# Altium schematic sheet SignalRouting.SchDoc: SignalRouting
size A3 portrait; Date: JUN 2020; ApprovedBy: Hören; CheckedBy: Mörz; Author: Rudziński; CompanyName: Semi-ATE; DrawnBy: Rudziński; Engineer: Hören; Organization: Semi-ATE; DocumentNumber: 7; Revision: V1.0; SheetNumber: 7; SheetTotal: 20
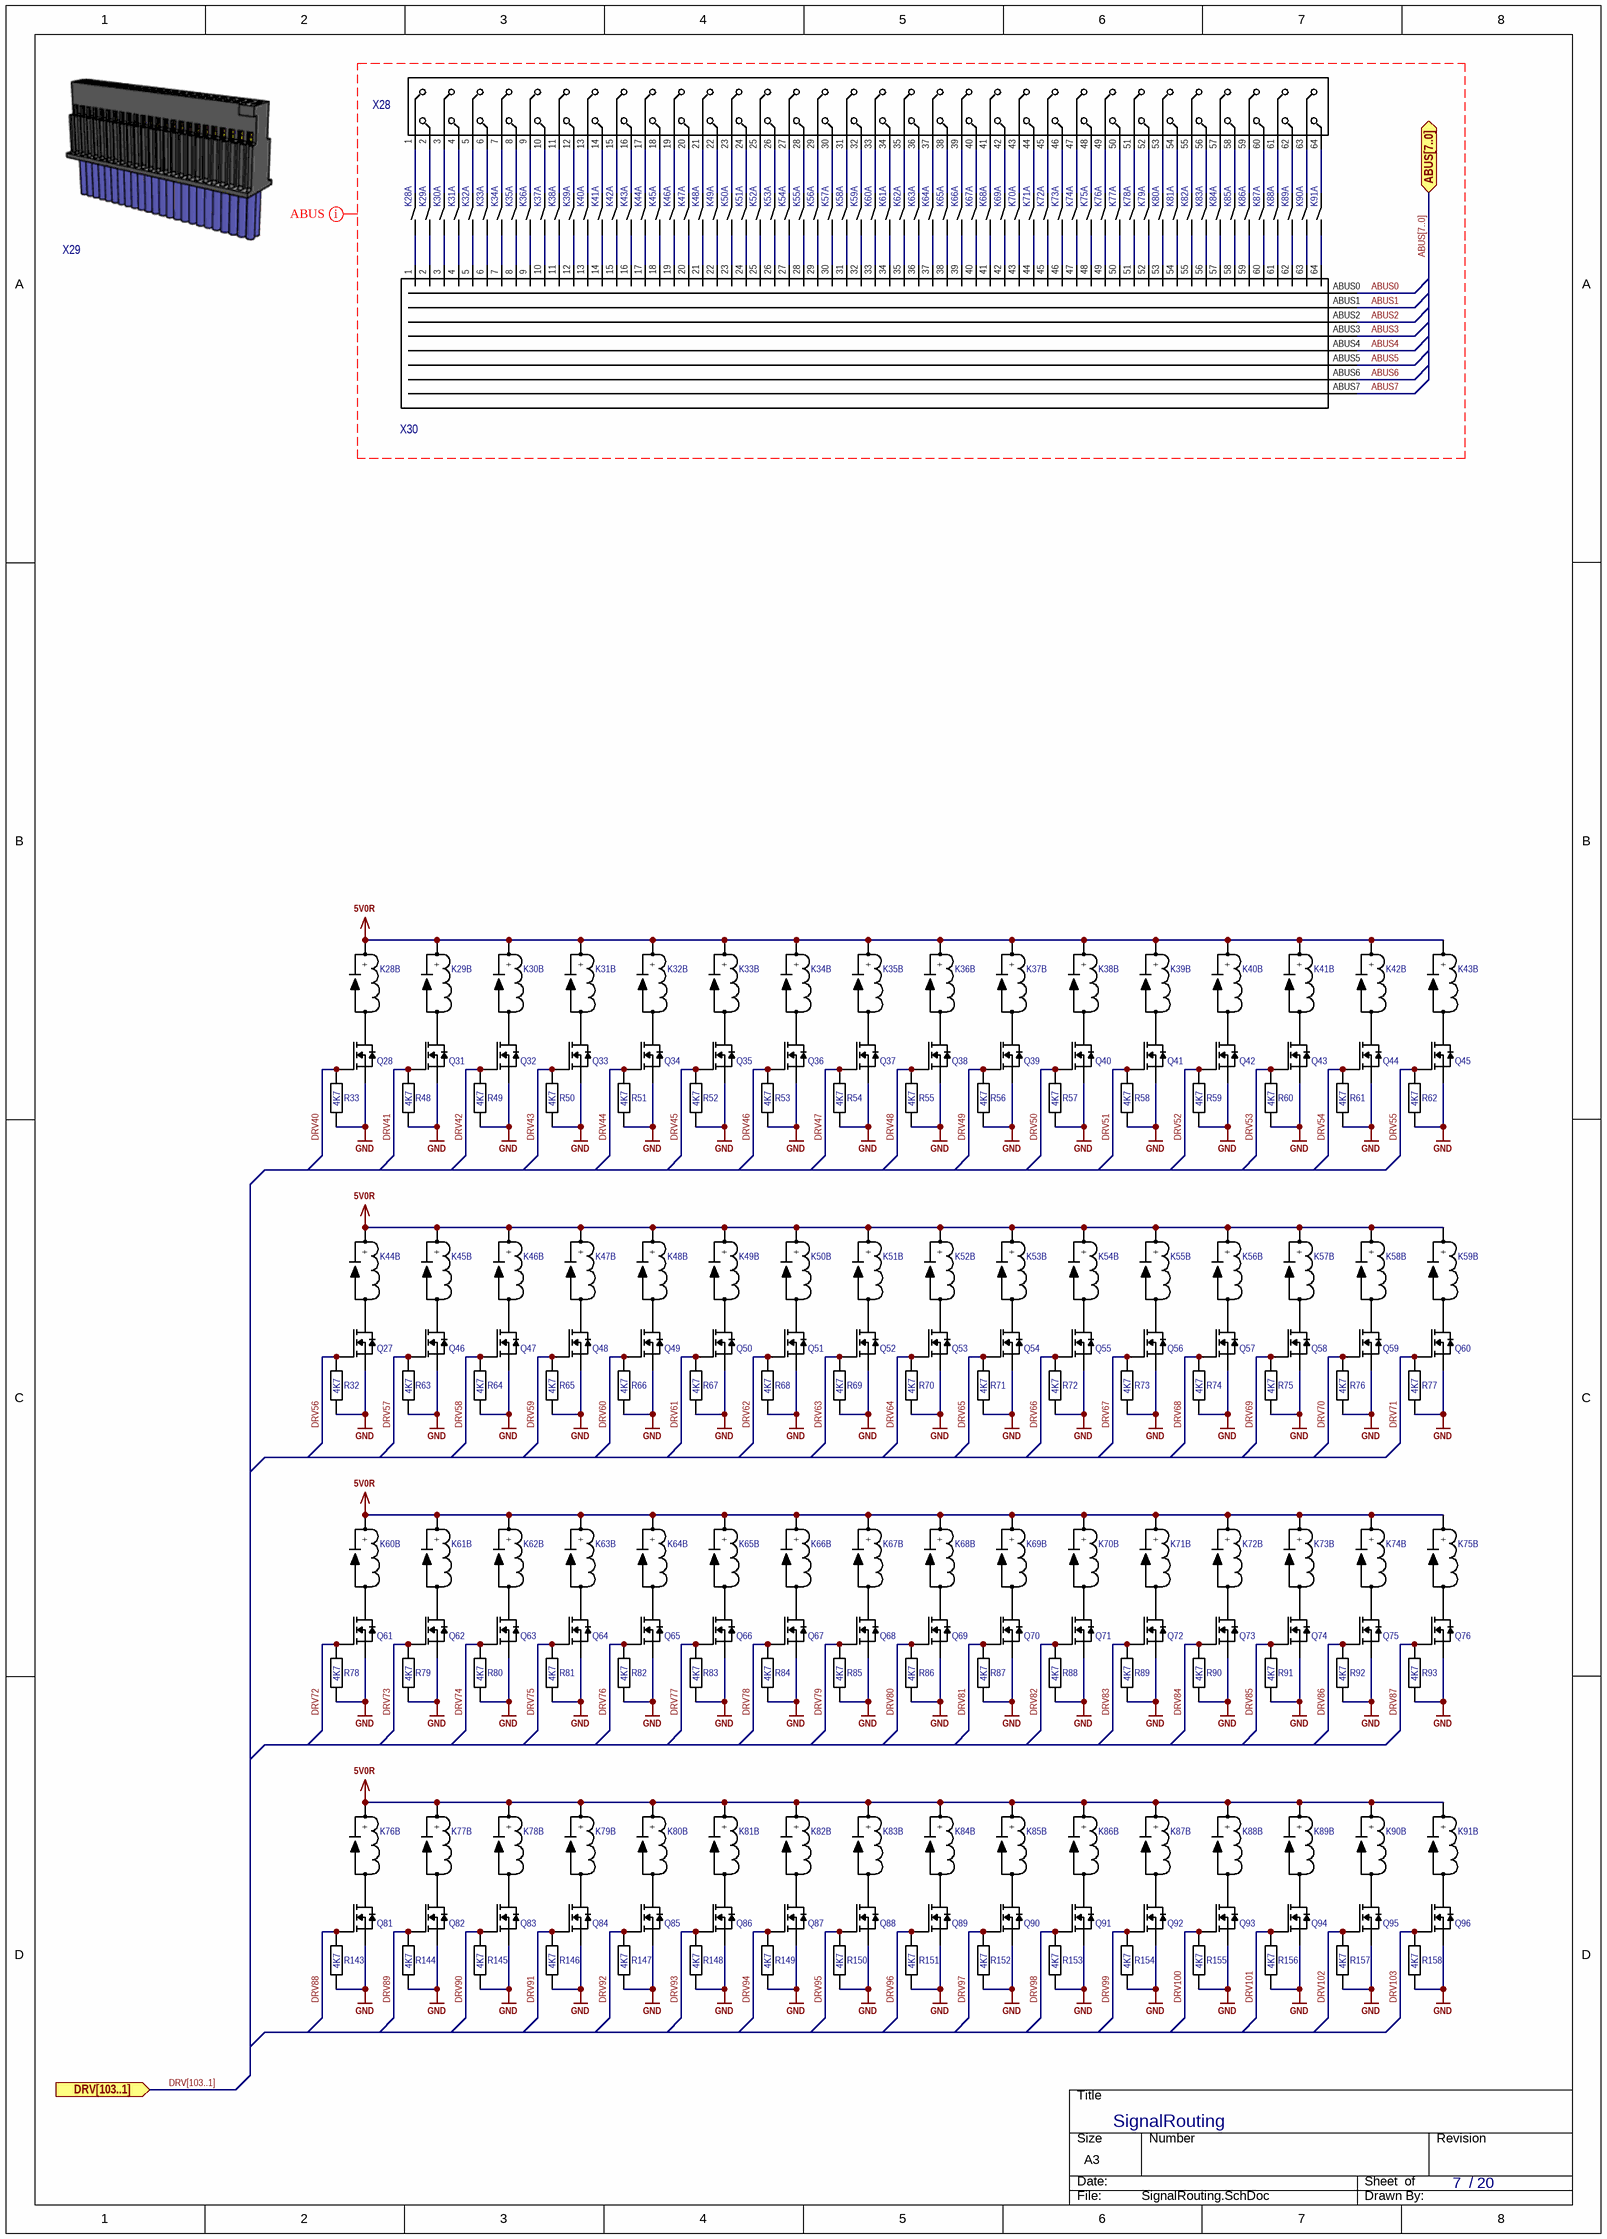
[diagram p0: SignalRouting.SchDoc]

## Parts
K28  K  [118-1A]  (value not drawn)  (parts A,B of 2)
K29  K  [118-1A]  (value not drawn)  (parts A,B of 2)
K30  K  [118-1A]  (value not drawn)  (parts A,B of 2)
K31  K  [118-1A]  (value not drawn)  (parts A,B of 2)
K32  K  [118-1A]  (value not drawn)  (parts A,B of 2)
K33  K  [118-1A]  (value not drawn)  (parts A,B of 2)
K34  K  [118-1A]  (value not drawn)  (parts A,B of 2)
K35  K  [118-1A]  (value not drawn)  (parts A,B of 2)
K36  K  [118-1A]  (value not drawn)  (parts A,B of 2)
K37  K  [118-1A]  (value not drawn)  (parts A,B of 2)
K38  K  [118-1A]  (value not drawn)  (parts A,B of 2)
K39  K  [118-1A]  (value not drawn)  (parts A,B of 2)
K40  K  [118-1A]  (value not drawn)  (parts A,B of 2)
K41  K  [118-1A]  (value not drawn)  (parts A,B of 2)
K42  K  [118-1A]  (value not drawn)  (parts A,B of 2)
K43  K  [118-1A]  (value not drawn)  (parts A,B of 2)
K44  K  [118-1A]  (value not drawn)  (parts A,B of 2)
K45  K  [118-1A]  (value not drawn)  (parts A,B of 2)
K46  K  [118-1A]  (value not drawn)  (parts A,B of 2)
K47  K  [118-1A]  (value not drawn)  (parts A,B of 2)
K48  K  [118-1A]  (value not drawn)  (parts A,B of 2)
K49  K  [118-1A]  (value not drawn)  (parts A,B of 2)
K50  K  [118-1A]  (value not drawn)  (parts A,B of 2)
K51  K  [118-1A]  (value not drawn)  (parts A,B of 2)
K52  K  [118-1A]  (value not drawn)  (parts A,B of 2)
K53  K  [118-1A]  (value not drawn)  (parts A,B of 2)
K54  K  [118-1A]  (value not drawn)  (parts A,B of 2)
K55  K  [118-1A]  (value not drawn)  (parts A,B of 2)
K56  K  [118-1A]  (value not drawn)  (parts A,B of 2)
K57  K  [118-1A]  (value not drawn)  (parts A,B of 2)
K58  K  [118-1A]  (value not drawn)  (parts A,B of 2)
K59  K  [118-1A]  (value not drawn)  (parts A,B of 2)
K60  K  [118-1A]  (value not drawn)  (parts A,B of 2)
K61  K  [118-1A]  (value not drawn)  (parts A,B of 2)
K62  K  [118-1A]  (value not drawn)  (parts A,B of 2)
K63  K  [118-1A]  (value not drawn)  (parts A,B of 2)
K64  K  [118-1A]  (value not drawn)  (parts A,B of 2)
K65  K  [118-1A]  (value not drawn)  (parts A,B of 2)
K66  K  [118-1A]  (value not drawn)  (parts A,B of 2)
K67  K  [118-1A]  (value not drawn)  (parts A,B of 2)
K68  K  [118-1A]  (value not drawn)  (parts A,B of 2)
K69  K  [118-1A]  (value not drawn)  (parts A,B of 2)
K70  K  [118-1A]  (value not drawn)  (parts A,B of 2)
K71  K  [118-1A]  (value not drawn)  (parts A,B of 2)
K72  K  [118-1A]  (value not drawn)  (parts A,B of 2)
K73  K  [118-1A]  (value not drawn)  (parts A,B of 2)
K74  K  [118-1A]  (value not drawn)  (parts A,B of 2)
K75  K  [118-1A]  (value not drawn)  (parts A,B of 2)
K76  K  [118-1A]  (value not drawn)  (parts A,B of 2)
K77  K  [118-1A]  (value not drawn)  (parts A,B of 2)
K78  K  [118-1A]  (value not drawn)  (parts A,B of 2)
K79  K  [118-1A]  (value not drawn)  (parts A,B of 2)
K80  K  [118-1A]  (value not drawn)  (parts A,B of 2)
K81  K  [118-1A]  (value not drawn)  (parts A,B of 2)
K82  K  [118-1A]  (value not drawn)  (parts A,B of 2)
K83  K  [118-1A]  (value not drawn)  (parts A,B of 2)
K84  K  [118-1A]  (value not drawn)  (parts A,B of 2)
K85  K  [118-1A]  (value not drawn)  (parts A,B of 2)
K86  K  [118-1A]  (value not drawn)  (parts A,B of 2)
K87  K  [118-1A]  (value not drawn)  (parts A,B of 2)
K88  K  [118-1A]  (value not drawn)  (parts A,B of 2)
K89  K  [118-1A]  (value not drawn)  (parts A,B of 2)
K90  K  [118-1A]  (value not drawn)  (parts A,B of 2)
K91  K  [118-1A]  (value not drawn)  (parts A,B of 2)
Q27  Q  [SOT23-3]  (value not drawn)
Q28  Q  [SOT23-3]  (value not drawn)
Q31  Q  [SOT23-3]  (value not drawn)
Q32  Q  [SOT23-3]  (value not drawn)
Q33  Q  [SOT23-3]  (value not drawn)
Q34  Q  [SOT23-3]  (value not drawn)
Q35  Q  [SOT23-3]  (value not drawn)
Q36  Q  [SOT23-3]  (value not drawn)
Q37  Q  [SOT23-3]  (value not drawn)
Q38  Q  [SOT23-3]  (value not drawn)
Q39  Q  [SOT23-3]  (value not drawn)
Q40  Q  [SOT23-3]  (value not drawn)
Q41  Q  [SOT23-3]  (value not drawn)
Q42  Q  [SOT23-3]  (value not drawn)
Q43  Q  [SOT23-3]  (value not drawn)
Q44  Q  [SOT23-3]  (value not drawn)
Q45  Q  [SOT23-3]  (value not drawn)
Q46  Q  [SOT23-3]  (value not drawn)
Q47  Q  [SOT23-3]  (value not drawn)
Q48  Q  [SOT23-3]  (value not drawn)
Q49  Q  [SOT23-3]  (value not drawn)
Q50  Q  [SOT23-3]  (value not drawn)
Q51  Q  [SOT23-3]  (value not drawn)
Q52  Q  [SOT23-3]  (value not drawn)
Q53  Q  [SOT23-3]  (value not drawn)
Q54  Q  [SOT23-3]  (value not drawn)
Q55  Q  [SOT23-3]  (value not drawn)
Q56  Q  [SOT23-3]  (value not drawn)
Q57  Q  [SOT23-3]  (value not drawn)
Q58  Q  [SOT23-3]  (value not drawn)
Q59  Q  [SOT23-3]  (value not drawn)
Q60  Q  [SOT23-3]  (value not drawn)
Q61  Q  [SOT23-3]  (value not drawn)
Q62  Q  [SOT23-3]  (value not drawn)
Q63  Q  [SOT23-3]  (value not drawn)
Q64  Q  [SOT23-3]  (value not drawn)
Q65  Q  [SOT23-3]  (value not drawn)
Q66  Q  [SOT23-3]  (value not drawn)
Q67  Q  [SOT23-3]  (value not drawn)
Q68  Q  [SOT23-3]  (value not drawn)
Q69  Q  [SOT23-3]  (value not drawn)
Q70  Q  [SOT23-3]  (value not drawn)
Q71  Q  [SOT23-3]  (value not drawn)
Q72  Q  [SOT23-3]  (value not drawn)
Q73  Q  [SOT23-3]  (value not drawn)
Q74  Q  [SOT23-3]  (value not drawn)
Q75  Q  [SOT23-3]  (value not drawn)
Q76  Q  [SOT23-3]  (value not drawn)
Q81  Q  [SOT23-3]  (value not drawn)
Q82  Q  [SOT23-3]  (value not drawn)
Q83  Q  [SOT23-3]  (value not drawn)
Q84  Q  [SOT23-3]  (value not drawn)
Q85  Q  [SOT23-3]  (value not drawn)
Q86  Q  [SOT23-3]  (value not drawn)
Q87  Q  [SOT23-3]  (value not drawn)
Q88  Q  [SOT23-3]  (value not drawn)
Q89  Q  [SOT23-3]  (value not drawn)
Q90  Q  [SOT23-3]  (value not drawn)
Q91  Q  [SOT23-3]  (value not drawn)
Q92  Q  [SOT23-3]  (value not drawn)
Q93  Q  [SOT23-3]  (value not drawn)
Q94  Q  [SOT23-3]  (value not drawn)
Q95  Q  [SOT23-3]  (value not drawn)
Q96  Q  [SOT23-3]  (value not drawn)
R32  value 4K7  [R0603 Reflow]  (hidden comment: R)
R33  value 4K7  [R0603 Reflow]  (hidden comment: R)
R48  value 4K7  [R0603 Reflow]  (hidden comment: R)
R49  value 4K7  [R0603 Reflow]  (hidden comment: R)
R50  value 4K7  [R0603 Reflow]  (hidden comment: R)
R51  value 4K7  [R0603 Reflow]  (hidden comment: R)
R52  value 4K7  [R0603 Reflow]  (hidden comment: R)
R53  value 4K7  [R0603 Reflow]  (hidden comment: R)
R54  value 4K7  [R0603 Reflow]  (hidden comment: R)
R55  value 4K7  [R0603 Reflow]  (hidden comment: R)
R56  value 4K7  [R0603 Reflow]  (hidden comment: R)
R57  value 4K7  [R0603 Reflow]  (hidden comment: R)
R58  value 4K7  [R0603 Reflow]  (hidden comment: R)
R59  value 4K7  [R0603 Reflow]  (hidden comment: R)
R60  value 4K7  [R0603 Reflow]  (hidden comment: R)
R61  value 4K7  [R0603 Reflow]  (hidden comment: R)
R62  value 4K7  [R0603 Reflow]  (hidden comment: R)
R63  value 4K7  [R0603 Reflow]  (hidden comment: R)
R64  value 4K7  [R0603 Reflow]  (hidden comment: R)
R65  value 4K7  [R0603 Reflow]  (hidden comment: R)
R66  value 4K7  [R0603 Reflow]  (hidden comment: R)
R67  value 4K7  [R0603 Reflow]  (hidden comment: R)
R68  value 4K7  [R0603 Reflow]  (hidden comment: R)
R69  value 4K7  [R0603 Reflow]  (hidden comment: R)
R70  value 4K7  [R0603 Reflow]  (hidden comment: R)
R71  value 4K7  [R0603 Reflow]  (hidden comment: R)
R72  value 4K7  [R0603 Reflow]  (hidden comment: R)
R73  value 4K7  [R0603 Reflow]  (hidden comment: R)
R74  value 4K7  [R0603 Reflow]  (hidden comment: R)
R75  value 4K7  [R0603 Reflow]  (hidden comment: R)
R76  value 4K7  [R0603 Reflow]  (hidden comment: R)
R77  value 4K7  [R0603 Reflow]  (hidden comment: R)
R78  value 4K7  [R0603 Reflow]  (hidden comment: R)
R79  value 4K7  [R0603 Reflow]  (hidden comment: R)
R80  value 4K7  [R0603 Reflow]  (hidden comment: R)
R81  value 4K7  [R0603 Reflow]  (hidden comment: R)
R82  value 4K7  [R0603 Reflow]  (hidden comment: R)
R83  value 4K7  [R0603 Reflow]  (hidden comment: R)
R84  value 4K7  [R0603 Reflow]  (hidden comment: R)
R85  value 4K7  [R0603 Reflow]  (hidden comment: R)
R86  value 4K7  [R0603 Reflow]  (hidden comment: R)
R87  value 4K7  [R0603 Reflow]  (hidden comment: R)
R88  value 4K7  [R0603 Reflow]  (hidden comment: R)
R89  value 4K7  [R0603 Reflow]  (hidden comment: R)
R90  value 4K7  [R0603 Reflow]  (hidden comment: R)
R91  value 4K7  [R0603 Reflow]  (hidden comment: R)
R92  value 4K7  [R0603 Reflow]  (hidden comment: R)
R93  value 4K7  [R0603 Reflow]  (hidden comment: R)
R143  value 4K7  [R0603 Reflow]  (hidden comment: R)
R144  value 4K7  [R0603 Reflow]  (hidden comment: R)
R145  value 4K7  [R0603 Reflow]  (hidden comment: R)
R146  value 4K7  [R0603 Reflow]  (hidden comment: R)
R147  value 4K7  [R0603 Reflow]  (hidden comment: R)
R148  value 4K7  [R0603 Reflow]  (hidden comment: R)
R149  value 4K7  [R0603 Reflow]  (hidden comment: R)
R150  value 4K7  [R0603 Reflow]  (hidden comment: R)
R151  value 4K7  [R0603 Reflow]  (hidden comment: R)
R152  value 4K7  [R0603 Reflow]  (hidden comment: R)
R153  value 4K7  [R0603 Reflow]  (hidden comment: R)
R154  value 4K7  [R0603 Reflow]  (hidden comment: R)
R155  value 4K7  [R0603 Reflow]  (hidden comment: R)
R156  value 4K7  [R0603 Reflow]  (hidden comment: R)
R157  value 4K7  [R0603 Reflow]  (hidden comment: R)
R158  value 4K7  [R0603 Reflow]  (hidden comment: R)
X28  X  [TFC-132-01-F-D-LA]  (value not drawn)
X29  X  (value not drawn)  (mechanical)
X30  X  [CONFIG64]  (value not drawn)  (no BOM)

## Ports
ABUS[7..0] (bidir), DRV[103..1] (in)

## Nets
5V0R: K28.1(+) K29.1(+) K30.1(+) K31.1(+) K32.1(+) K33.1(+) K34.1(+) K35.1(+) K36.1(+) K37.1(+) K38.1(+) K39.1(+) K40.1(+) K41.1(+) K42.1(+) K43.1(+) K44.1(+) K45.1(+) K46.1(+) K47.1(+) K48.1(+) K49.1(+) K50.1(+) K51.1(+) K52.1(+) K53.1(+) K54.1(+) K55.1(+) K56.1(+) K57.1(+) K58.1(+) K59.1(+) K60.1(+) K61.1(+) K62.1(+) K63.1(+) K64.1(+) K65.1(+) K66.1(+) K67.1(+) K68.1(+) K69.1(+) K70.1(+) K71.1(+) K72.1(+) K73.1(+) K74.1(+) K75.1(+) K76.1(+) K77.1(+) K78.1(+) K79.1(+) K80.1(+) K81.1(+) K82.1(+) K83.1(+) K84.1(+) K85.1(+) K86.1(+) K87.1(+) K88.1(+) K89.1(+) K90.1(+) K91.1(+)
GND: Q27.2(S) Q28.2(S) Q31.2(S) Q32.2(S) Q33.2(S) Q34.2(S) Q35.2(S) Q36.2(S) Q37.2(S) Q38.2(S) Q39.2(S) Q40.2(S) Q41.2(S) Q42.2(S) Q43.2(S) Q44.2(S) Q45.2(S) Q46.2(S) Q47.2(S) Q48.2(S) Q49.2(S) Q50.2(S) Q51.2(S) Q52.2(S) Q53.2(S) Q54.2(S) Q55.2(S) Q56.2(S) Q57.2(S) Q58.2(S) Q59.2(S) Q60.2(S) Q61.2(S) Q62.2(S) Q63.2(S) Q64.2(S) Q65.2(S) Q66.2(S) Q67.2(S) Q68.2(S) Q69.2(S) Q70.2(S) Q71.2(S) Q72.2(S) Q73.2(S) Q74.2(S) Q75.2(S) Q76.2(S) Q81.2(S) Q82.2(S) Q83.2(S) Q84.2(S) Q85.2(S) Q86.2(S) Q87.2(S) Q88.2(S) Q89.2(S) Q90.2(S) Q91.2(S) Q92.2(S) Q93.2(S) Q94.2(S) Q95.2(S) Q96.2(S) R32.1 R33.1 R48.1 R49.1 R50.1 R51.1 R52.1 R53.1 R54.1 R55.1 R56.1 R57.1 R58.1 R59.1 R60.1 R61.1 R62.1 R63.1 R64.1 R65.1 R66.1 R67.1 R68.1 R69.1 R70.1 R71.1 R72.1 R73.1 R74.1 R75.1 R76.1 R77.1 R78.1 R79.1 R80.1 R81.1 R82.1 R83.1 R84.1 R85.1 R86.1 R87.1 R88.1 R89.1 R90.1 R91.1 R92.1 R93.1 R143.1 R144.1 R145.1 R146.1 R147.1 R148.1 R149.1 R150.1 R151.1 R152.1 R153.1 R154.1 R155.1 R156.1 R157.1 R158.1
ABUS0: X30.ABUS0
ABUS1: X30.ABUS1
ABUS2: X30.ABUS2
ABUS3: X30.ABUS3
ABUS4: X30.ABUS4
ABUS5: X30.ABUS5
ABUS6: X30.ABUS6
ABUS7: X30.ABUS7
DRV40: Q28.1(G) R33.2
DRV41: Q31.1(G) R48.2
DRV42: Q32.1(G) R49.2
DRV43: Q33.1(G) R50.2
DRV44: Q34.1(G) R51.2
DRV45: Q35.1(G) R52.2
DRV46: Q36.1(G) R53.2
DRV47: Q37.1(G) R54.2
DRV48: Q38.1(G) R55.2
DRV49: Q39.1(G) R56.2
DRV50: Q40.1(G) R57.2
DRV51: Q41.1(G) R58.2
DRV52: Q42.1(G) R59.2
DRV53: Q43.1(G) R60.2
DRV54: Q44.1(G) R61.2
DRV55: Q45.1(G) R62.2
DRV56: Q27.1(G) R32.2
DRV57: Q46.1(G) R63.2
DRV58: Q47.1(G) R64.2
DRV59: Q48.1(G) R65.2
DRV60: Q49.1(G) R66.2
DRV61: Q50.1(G) R67.2
DRV62: Q51.1(G) R68.2
DRV63: Q52.1(G) R69.2
DRV64: Q53.1(G) R70.2
DRV65: Q54.1(G) R71.2
DRV66: Q55.1(G) R72.2
DRV67: Q56.1(G) R73.2
DRV68: Q57.1(G) R74.2
DRV69: Q58.1(G) R75.2
DRV70: Q59.1(G) R76.2
DRV71: Q60.1(G) R77.2
DRV72: Q61.1(G) R78.2
DRV73: Q62.1(G) R79.2
DRV74: Q63.1(G) R80.2
DRV75: Q64.1(G) R81.2
DRV76: Q65.1(G) R82.2
DRV77: Q66.1(G) R83.2
DRV78: Q67.1(G) R84.2
DRV79: Q68.1(G) R85.2
DRV80: Q69.1(G) R86.2
DRV81: Q70.1(G) R87.2
DRV82: Q71.1(G) R88.2
DRV83: Q72.1(G) R89.2
DRV84: Q73.1(G) R90.2
DRV85: Q74.1(G) R91.2
DRV86: Q75.1(G) R92.2
DRV87: Q76.1(G) R93.2
DRV88: Q81.1(G) R143.2
DRV89: Q82.1(G) R144.2
DRV90: Q83.1(G) R145.2
DRV91: Q84.1(G) R146.2
DRV92: Q85.1(G) R147.2
DRV93: Q86.1(G) R148.2
DRV94: Q87.1(G) R149.2
DRV95: Q88.1(G) R150.2
DRV96: Q89.1(G) R151.2
DRV97: Q90.1(G) R152.2
DRV98: Q91.1(G) R153.2
DRV99: Q92.1(G) R154.2
DRV100: Q93.1(G) R155.2
DRV101: Q94.1(G) R156.2
DRV102: Q95.1(G) R157.2
DRV103: Q96.1(G) R158.2
NetK28_2: K28.2(-) Q28.3(D)
NetK28_3: K28.3(CA) X30.1
NetK28_4: K28.4(CB) X28.1
NetK29_2: K29.2(-) Q31.3(D)
NetK29_3: K29.3(CA) X30.2
NetK29_4: K29.4(CB) X28.2
NetK30_2: K30.2(-) Q32.3(D)
NetK30_3: K30.3(CA) X30.3
NetK30_4: K30.4(CB) X28.3
NetK31_2: K31.2(-) Q33.3(D)
NetK31_3: K31.3(CA) X30.4
NetK31_4: K31.4(CB) X28.4
NetK32_2: K32.2(-) Q34.3(D)
NetK32_3: K32.3(CA) X30.5
NetK32_4: K32.4(CB) X28.5
NetK33_2: K33.2(-) Q35.3(D)
NetK33_3: K33.3(CA) X30.6
NetK33_4: K33.4(CB) X28.6
NetK34_2: K34.2(-) Q36.3(D)
NetK34_3: K34.3(CA) X30.7
NetK34_4: K34.4(CB) X28.7
NetK35_2: K35.2(-) Q37.3(D)
NetK35_3: K35.3(CA) X30.8
NetK35_4: K35.4(CB) X28.8
NetK36_2: K36.2(-) Q38.3(D)
NetK36_3: K36.3(CA) X30.9
NetK36_4: K36.4(CB) X28.9
NetK37_2: K37.2(-) Q39.3(D)
NetK37_3: K37.3(CA) X30.10
NetK37_4: K37.4(CB) X28.10
NetK38_2: K38.2(-) Q40.3(D)
NetK38_3: K38.3(CA) X30.11
NetK38_4: K38.4(CB) X28.11
NetK39_2: K39.2(-) Q41.3(D)
NetK39_3: K39.3(CA) X30.12
NetK39_4: K39.4(CB) X28.12
NetK40_2: K40.2(-) Q42.3(D)
NetK40_3: K40.3(CA) X30.13
NetK40_4: K40.4(CB) X28.13
NetK41_2: K41.2(-) Q43.3(D)
NetK41_3: K41.3(CA) X30.14
NetK41_4: K41.4(CB) X28.14
NetK42_2: K42.2(-) Q44.3(D)
NetK42_3: K42.3(CA) X30.15
NetK42_4: K42.4(CB) X28.15
NetK43_2: K43.2(-) Q45.3(D)
NetK43_3: K43.3(CA) X30.16
NetK43_4: K43.4(CB) X28.16
NetK44_2: K44.2(-) Q27.3(D)
NetK44_3: K44.3(CA) X30.17
NetK44_4: K44.4(CB) X28.17
NetK45_2: K45.2(-) Q46.3(D)
NetK45_3: K45.3(CA) X30.18
NetK45_4: K45.4(CB) X28.18
NetK46_2: K46.2(-) Q47.3(D)
NetK46_3: K46.3(CA) X30.19
NetK46_4: K46.4(CB) X28.19
NetK47_2: K47.2(-) Q48.3(D)
NetK47_3: K47.3(CA) X30.20
NetK47_4: K47.4(CB) X28.20
NetK48_2: K48.2(-) Q49.3(D)
NetK48_3: K48.3(CA) X30.21
NetK48_4: K48.4(CB) X28.21
NetK49_2: K49.2(-) Q50.3(D)
NetK49_3: K49.3(CA) X30.22
NetK49_4: K49.4(CB) X28.22
NetK50_2: K50.2(-) Q51.3(D)
NetK50_3: K50.3(CA) X30.23
NetK50_4: K50.4(CB) X28.23
NetK51_2: K51.2(-) Q52.3(D)
NetK51_3: K51.3(CA) X30.24
NetK51_4: K51.4(CB) X28.24
NetK52_2: K52.2(-) Q53.3(D)
NetK52_3: K52.3(CA) X30.25
NetK52_4: K52.4(CB) X28.25
NetK53_2: K53.2(-) Q54.3(D)
NetK53_3: K53.3(CA) X30.26
NetK53_4: K53.4(CB) X28.26
NetK54_2: K54.2(-) Q55.3(D)
NetK54_3: K54.3(CA) X30.27
NetK54_4: K54.4(CB) X28.27
NetK55_2: K55.2(-) Q56.3(D)
NetK55_3: K55.3(CA) X30.28
NetK55_4: K55.4(CB) X28.28
NetK56_2: K56.2(-) Q57.3(D)
NetK56_3: K56.3(CA) X30.29
NetK56_4: K56.4(CB) X28.29
NetK57_2: K57.2(-) Q58.3(D)
NetK57_3: K57.3(CA) X30.30
NetK57_4: K57.4(CB) X28.30
NetK58_2: K58.2(-) Q59.3(D)
NetK58_3: K58.3(CA) X30.31
NetK58_4: K58.4(CB) X28.31
NetK59_2: K59.2(-) Q60.3(D)
NetK59_3: K59.3(CA) X30.32
NetK59_4: K59.4(CB) X28.32
NetK60_2: K60.2(-) Q61.3(D)
NetK60_3: K60.3(CA) X30.33
NetK60_4: K60.4(CB) X28.33
NetK61_2: K61.2(-) Q62.3(D)
NetK61_3: K61.3(CA) X30.34
NetK61_4: K61.4(CB) X28.34
NetK62_2: K62.2(-) Q63.3(D)
NetK62_3: K62.3(CA) X30.35
NetK62_4: K62.4(CB) X28.35
NetK63_2: K63.2(-) Q64.3(D)
NetK63_3: K63.3(CA) X30.36
NetK63_4: K63.4(CB) X28.36
NetK64_2: K64.2(-) Q65.3(D)
NetK64_3: K64.3(CA) X30.37
NetK64_4: K64.4(CB) X28.37
NetK65_2: K65.2(-) Q66.3(D)
NetK65_3: K65.3(CA) X30.38
NetK65_4: K65.4(CB) X28.38
NetK66_2: K66.2(-) Q67.3(D)
NetK66_3: K66.3(CA) X30.39
NetK66_4: K66.4(CB) X28.39
NetK67_2: K67.2(-) Q68.3(D)
NetK67_3: K67.3(CA) X30.40
NetK67_4: K67.4(CB) X28.40
NetK68_2: K68.2(-) Q69.3(D)
NetK68_3: K68.3(CA) X30.41
NetK68_4: K68.4(CB) X28.41
NetK69_2: K69.2(-) Q70.3(D)
NetK69_3: K69.3(CA) X30.42
NetK69_4: K69.4(CB) X28.42
NetK70_2: K70.2(-) Q71.3(D)
NetK70_3: K70.3(CA) X30.43
NetK70_4: K70.4(CB) X28.43
NetK71_2: K71.2(-) Q72.3(D)
NetK71_3: K71.3(CA) X30.44
NetK71_4: K71.4(CB) X28.44
NetK72_2: K72.2(-) Q73.3(D)
NetK72_3: K72.3(CA) X30.45
NetK72_4: K72.4(CB) X28.45
NetK73_2: K73.2(-) Q74.3(D)
NetK73_3: K73.3(CA) X30.46
NetK73_4: K73.4(CB) X28.46
NetK74_2: K74.2(-) Q75.3(D)
NetK74_3: K74.3(CA) X30.47
NetK74_4: K74.4(CB) X28.47
NetK75_2: K75.2(-) Q76.3(D)
NetK75_3: K75.3(CA) X30.48
NetK75_4: K75.4(CB) X28.48
NetK76_2: K76.2(-) Q81.3(D)
NetK76_3: K76.3(CA) X30.49
NetK76_4: K76.4(CB) X28.49
NetK77_2: K77.2(-) Q82.3(D)
NetK77_3: K77.3(CA) X30.50
NetK77_4: K77.4(CB) X28.50
NetK78_2: K78.2(-) Q83.3(D)
NetK78_3: K78.3(CA) X30.51
NetK78_4: K78.4(CB) X28.51
NetK79_2: K79.2(-) Q84.3(D)
NetK79_3: K79.3(CA) X30.52
NetK79_4: K79.4(CB) X28.52
NetK80_2: K80.2(-) Q85.3(D)
NetK80_3: K80.3(CA) X30.53
NetK80_4: K80.4(CB) X28.53
NetK81_2: K81.2(-) Q86.3(D)
NetK81_3: K81.3(CA) X30.54
NetK81_4: K81.4(CB) X28.54
NetK82_2: K82.2(-) Q87.3(D)
NetK82_3: K82.3(CA) X30.55
NetK82_4: K82.4(CB) X28.55
NetK83_2: K83.2(-) Q88.3(D)
NetK83_3: K83.3(CA) X30.56
NetK83_4: K83.4(CB) X28.56
NetK84_2: K84.2(-) Q89.3(D)
NetK84_3: K84.3(CA) X30.57
NetK84_4: K84.4(CB) X28.57
NetK85_2: K85.2(-) Q90.3(D)
NetK85_3: K85.3(CA) X30.58
NetK85_4: K85.4(CB) X28.58
NetK86_2: K86.2(-) Q91.3(D)
NetK86_3: K86.3(CA) X30.59
NetK86_4: K86.4(CB) X28.59
NetK87_2: K87.2(-) Q92.3(D)
NetK87_3: K87.3(CA) X30.60
NetK87_4: K87.4(CB) X28.60
NetK88_2: K88.2(-) Q93.3(D)
NetK88_3: K88.3(CA) X30.61
NetK88_4: K88.4(CB) X28.61
NetK89_2: K89.2(-) Q94.3(D)
NetK89_3: K89.3(CA) X30.62
NetK89_4: K89.4(CB) X28.62
NetK90_2: K90.2(-) Q95.3(D)
NetK90_3: K90.3(CA) X30.63
NetK90_4: K90.4(CB) X28.63
NetK91_2: K91.2(-) Q96.3(D)
NetK91_3: K91.3(CA) X30.64
NetK91_4: K91.4(CB) X28.64

## Buses and harness runs
bus ABUS[7..0] = port ABUS[7..0]
bus DRV[103..1] = port DRV[103..1]

## Layout directives
net class ABUS: ABUS0, ABUS1, ABUS2, ABUS3, ABUS4, ABUS5, ABUS6, ABUS7, ABUS[7..0]

## Notes on the sheet
- /
- designed by
- reviewed by
- last drawn by
- Schematic:
- Project:
- last printed
- DIN-A3 P
- sheets
- of
- File:

## Library data of the parts
K28-K91 = 118-1-A-5/2D: 5V Signal Relais, Normal Open; 04. Manufacturer: Pickering; 03. Unit Price: 2.60; 05. Quantity: 1000; 06. Data Sheet: Pickering_series_118.pdf; 13. Created Date/Name: 20.12.17 S. Kaiser; Coil Resistance: 1500 Ohm; Max Carry Current: 1.2 A; Max Switch Current: 1A; Max Switch Voltage: 200V; Power Rating: 15W; 01. Distributor: Pickering; 02. Distributor Part Number: 118-1-A-5/2D; 07. Manufacturer  Part Number: 118-1-A-5/2D; 09. Operating Temperature: -20°C ~ +85°C; 11. RoHS: 2011/65/EU; ComponentLink1Description: Info; ComponentLink1URL: http://www.pickeringrelay.com/; ComponentLink2Description: DataSheet; ComponentLink2URL: https://www.pickeringrelay.com/products/single-line-sil-series-111-119/single-line-sil-series-118/; Coil Voltage: 5V
Q27 Q28 Q31-Q76 Q81-Q96 = FDV303N: MOSFET N-CH 25V 680MA SOT-23; 04. Manufacturer: ON Semiconductor; 03. Unit Price: 0.41; 13. Created Date/Name: AUG 2018 / Hören; Rds On: 450 mΩ @ id=500mA & Vgs=4.5V; Vgs,th: 1.5V @ 250uA; Power Rating: 350mW; 3D-Export: No; 01. Distributor: DigiKey; 02. Distributor Part Number: FDV303NDKR-ND; 07. Manufacturer  Part Number: FDV303N; 09. Operating Temperature: -55°C ~ 150°C (TJ); 11. RoHS: YES; ComponentLink1Description: Info; ComponentLink1URL: https://www.digikey.de/product-detail/en/on-semiconductor/FDV303N/FDV303NDKR-ND/1630434; ComponentLink2Description: DataSheet; ComponentLink2URL: https://media.digikey.com/pdf/Data%20Sheets/Fairchild%20PDFs/FDV303N.pdf; Vdss: 25V; Id: 680mA
R32 R33 R48-R93 R143-R158 = R: RES SMD 4.7K OHM 1% 1/10W 0603; 04. Manufacturer: Yageo; 07. Manufacturer  Part Number: RC0603FR-074K7L; 03. Unit Price: 0.09; 13. Created Date/Name: AUG2018/Hören; Tolerance: ±1%; ComponentLink1URL: *; ComponentLink1Description: Info; 02. Distributor Part Number: 311-4.70KHRCT-ND; 09. Operating Temperature: -xx..+yy°C; 11. RoHS: ???; 01. Distributor: DigiKey; ComponentLink2Description: DataSheet; Package: *
X28 = TFC-132-01-F-D-LA: CONN HEADER TH Straight 64POS 1.27MM; 04. Manufacturer: Samtec Inc.; 07. Manufacturer  Part Number: TFC-132-01-F-D-LC; 03. Unit Price: 5; 13. Created Date/Name: ??? / Hören; System: Connector; 01. Distributor: Samtec Inc.; 02. Distributor Part Number: TFC-132-01-F-D-LC; 11. RoHS: YES; ComponentLink1Description: Info; ComponentLink1URL: https://www.samtec.com/products/tfc-124-01-f-d-ra; ComponentLink2Description: DataSheet
X29 = SFSD-32-30C-G-15.00-S: 32 x 2 x 1.27mm SOCKET DISCRETE CABL COLORED; 04. Manufacturer: Samtec Inc.; 03. Unit Price: 10; 13. Created Date/Name: ??? / Hören; 01. Distributor: Samtec Inc.; 02. Distributor Part Number: SFSD-32-30C-G-15.00-S; 07. Manufacturer  Part Number: SFSD-32-30C-G-15.00-S; 11. RoHS: YES; ComponentLink1Description: Info; ComponentLink1URL: https://www.samtec.com/products/sfsd-24-30c-g-15.00-s; ComponentLink2Description: DataSheet
X30 = CONFIG64: PCB Tester Configuration Matrix for 64 Relays over 8 ABUSes; 13. Created Date/Name: ??? / Hören; ComponentLink1Description: Info; ComponentLink2Description: DataSheet